# EAGLE design platform_driver_all1 (EAGLE 6.5.0)
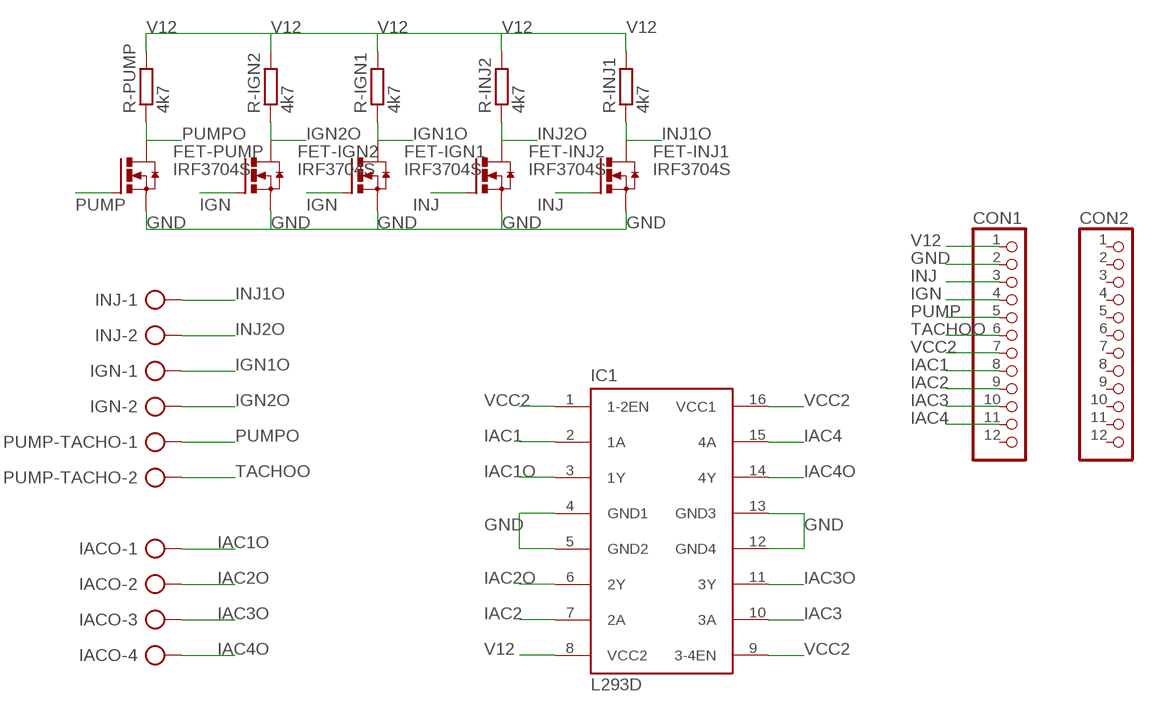
[diagram p0: schematic, sheet 1]

## Parts
CON1  PINHD-1X12  [1X12]
CON2  PINHD-1X12  [1X12]
FET-IGN1  IRF3704S  [D2PACK]
FET-IGN2  IRF3704S  [D2PACK]
FET-INJ1  IRF3704S  [D2PACK]
FET-INJ2  IRF3704S  [D2PACK]
FET-PUMP  IRF3704S  [D2PACK]
IACO  AK300/4  [AK300/4]
IC1  L293D  [DIL16]
IGN  AK300/2  [AK300/2]
INJ  AK300/2  [AK300/2]
PUMP-TACHO  AK300/2  [AK300/2]
R-IGN1  4k7  R-EU_M1206  [M1206]
R-IGN2  4k7  R-EU_M1206  [M1206]
R-INJ1  4k7  R-EU_M1206  [M1206]
R-INJ2  4k7  R-EU_M1206  [M1206]
R-PUMP  4k7  R-EU_M1206  [M1206]

## Nets
GND: CON1.2 FET-IGN1.3(S) FET-IGN2.3(S) FET-INJ1.3(S) FET-INJ2.3(S) FET-PUMP.3(S) IC1.4(GND1) IC1.5(GND2) IC1.12(GND4) IC1.13(GND3)
IAC1: CON1.8 IC1.2(1A)
IAC1O: IACO.1 IC1.3(1Y)
IAC2: CON1.9 IC1.7(2A)
IAC2O: IACO.2 IC1.6(2Y)
IAC3: CON1.10 IC1.10(3A)
IAC3O: IACO.3 IC1.11(3Y)
IAC4: CON1.11 IC1.15(4A)
IAC4O: IACO.4 IC1.14(4Y)
IGN: CON1.4 FET-IGN1.1(G) FET-IGN2.1(G)
IGN1O: FET-IGN1.2(D) IGN.1 R-IGN1.1
IGN2O: FET-IGN2.2(D) IGN.2 R-IGN2.1
INJ: CON1.3 FET-INJ1.1(G) FET-INJ2.1(G)
INJ1O: FET-INJ1.2(D) INJ.1 R-INJ1.1
INJ2O: FET-INJ2.2(D) INJ.2 R-INJ2.1
PUMP: CON1.5 FET-PUMP.1(G)
PUMPO: FET-PUMP.2(D) PUMP-TACHO.1 R-PUMP.1
TACHOO: CON1.6 PUMP-TACHO.2
V12: CON1.1 IC1.8(VCC2) R-IGN1.2 R-IGN2.2 R-INJ1.2 R-INJ2.2 R-PUMP.2
VCC2: CON1.7 IC1.1(1-2EN) IC1.9(3-4EN) IC1.16(VCC1)
Unconnected: CON1.12 CON2.1 CON2.2 CON2.3 CON2.4 CON2.5 CON2.6 CON2.7 CON2.8 CON2.9 CON2.10 CON2.11 CON2.12

## Library data of the parts
CON1 CON2 = pinhead:PINHD-1X12: PIN HEADER
FET-IGN1 FET-IGN2 FET-INJ1 FET-INJ2 FET-PUMP = transistor-power:IRF3704: SMPS MOSFET HEXFET® Power MOSFET Source: http://www.irf.com/product-info/datasheets/data/irf3704.pdf
IACO = con-ptr500:AK300/4: CONNECTOR; OC_FARNELL: unknown; OC_NEWARK: unknown
IC1 = st-microelectronics:L293D: PUSH-PULL 4 CHANNEL DRIVER; MPN: L293D; OC_FARNELL: 9589619; OC_NEWARK: 56P8249
IGN INJ PUMP-TACHO = con-ptr500:AK300/2: CONNECTOR; OC_FARNELL: unknown; OC_NEWARK: unknown
R-IGN1 R-IGN2 R-INJ1 R-INJ2 R-PUMP = resistor:R-EU_: RESISTOR, European symbol

## Board
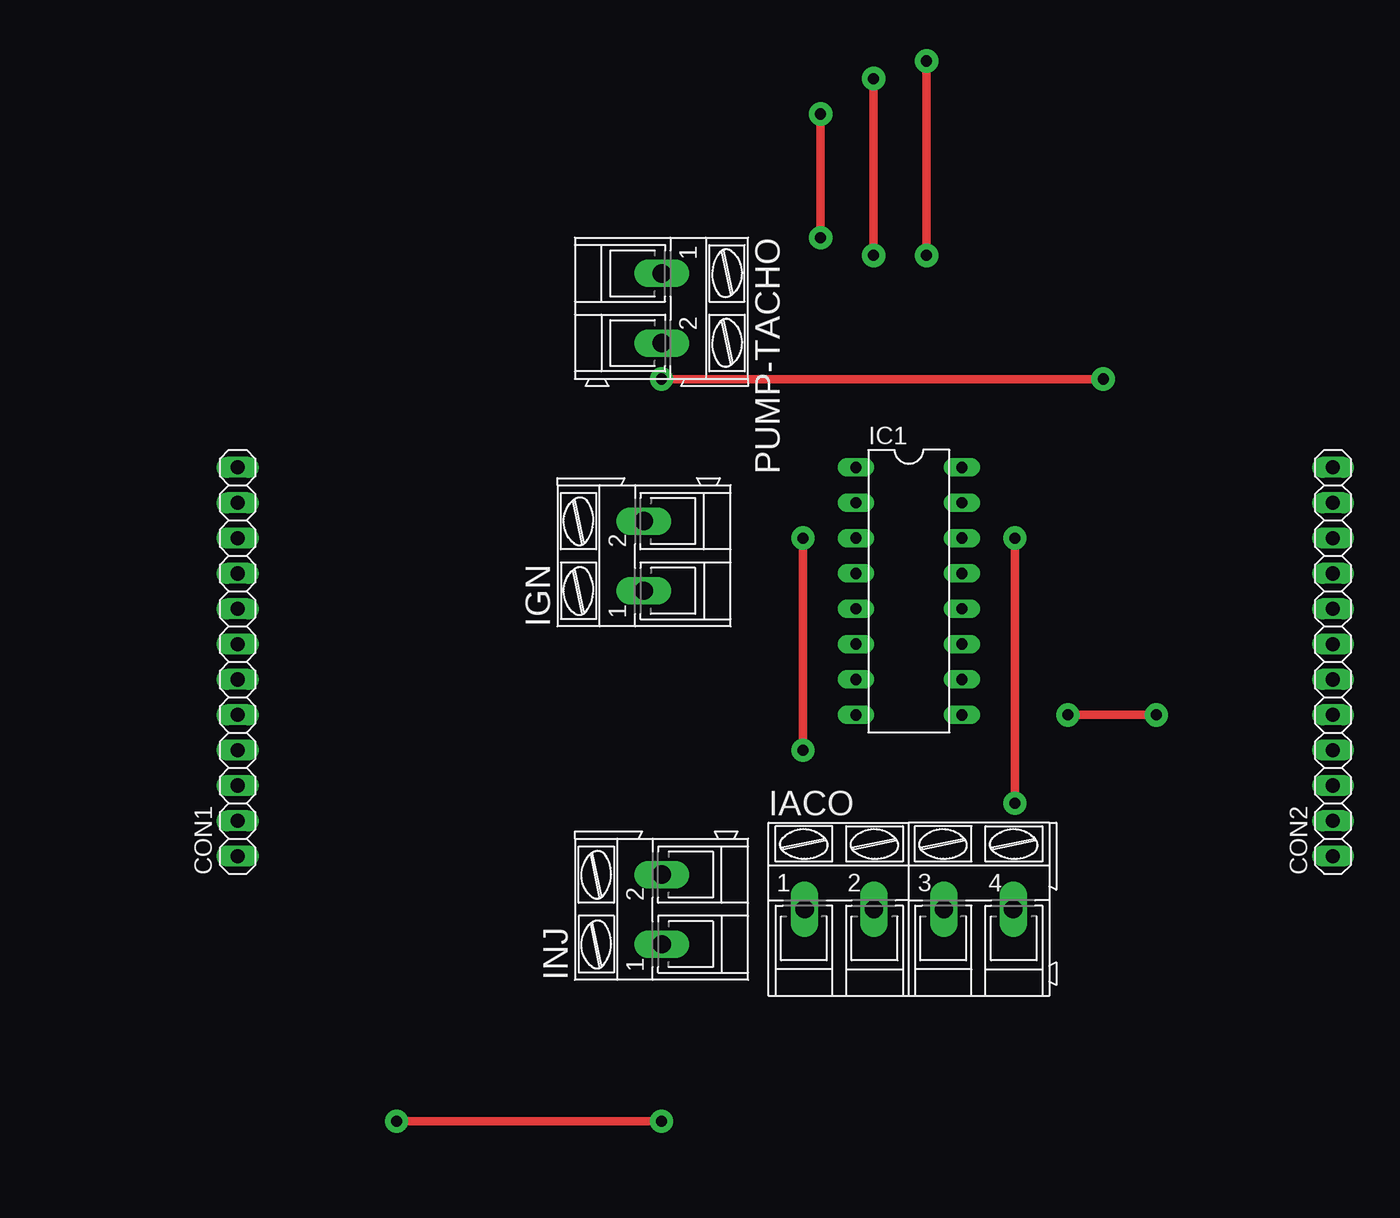
[diagram p1: board, top side]
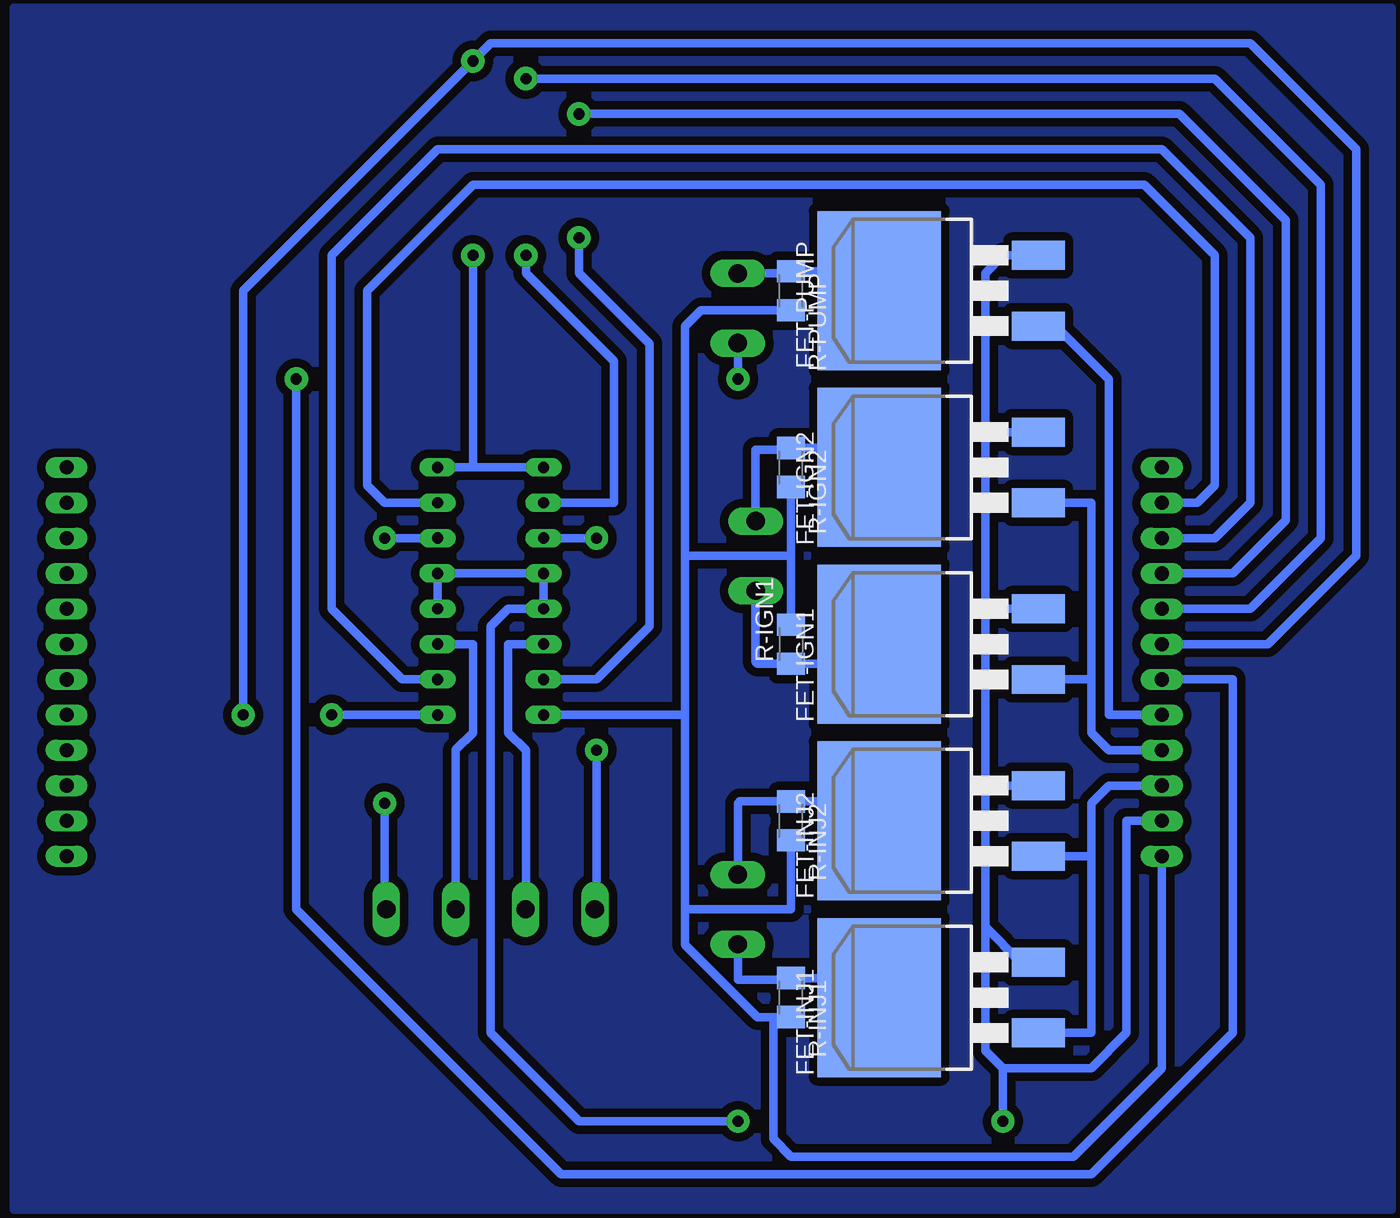
[diagram p2: board, bottom side, seen from below]

No outline drawn. Coordinates in mm, seen from the top.
Copper layers (1*16): Top 0.035mm / dielectric 1.5mm / Bottom 0.035mm
Design rules "default": minimum track width 10mil, minimum drill 24mil, track to track 8mil, track to pad 8mil, pad to pad 8mil, via to via 8mil, smd to smd 8mil, copper to edge 40mil, drill to drill 8mil, minimum pad ring 10mil, minimum via ring 8mil, stop-mask expansion 4mil, vias tented up to drill 0mil, thermal gap 10mil

### Footprints (pad centres in the part's own frame; a part is rotated, then mirrored left to right if it is on the bottom)
1X12 = drill 1.016 long: 1 -13.97,0; 2 -11.43,0; 3 -8.89,0; 4 -6.35,0; 5 -3.81,0; 6 -1.27,0; 7 1.27,0; 8 3.81,0; 9 6.35,0; 10 8.89,0; 11 11.43,0; 12 13.97,0
D2PACK = smd 2.083 x 3.81: 1 -2.54,-8.89; 3 2.54,-8.89 | smd 11.43 x 8.89: 2 0,2.54
AK300/4 = drill 1.321 long: 1 -7.493,0; 2 -2.515,0; 3 2.515,0; 4 7.493,0
DIL16 = drill 0.813 long: 1 -8.89,-3.81; 2 -6.35,-3.81; 3 -3.81,-3.81; 4 -1.27,-3.81; 5 1.27,-3.81; 6 3.81,-3.81; 7 6.35,-3.81; 8 8.89,-3.81; 9 8.89,3.81; 10 6.35,3.81; 11 3.81,3.81; 12 1.27,3.81; 13 -1.27,3.81; 14 -3.81,3.81; 15 -6.35,3.81; 16 -8.89,3.81
AK300/2 = drill 1.321 long: 1 -2.515,0; 2 2.489,0
M1206 = smd 1.6 x 2: 1 -1.4,0; 2 1.4,0

### Placement (x,y rotation side)
CON1  17.78,39.37 90 top
CON2  96.52,39.37 90 top
FET-IGN1  35.56,40.64 90 bottom
FET-IGN2  35.56,53.34 90 bottom
FET-INJ1  35.56,15.24 90 bottom
FET-INJ2  35.56,27.94 90 bottom
FET-PUMP  35.56,66.04 90 bottom
IACO  66.04,21.59 0 top
IC1  66.04,44.45 270 top
IGN  46.99,46.99 90 top
INJ  48.26,21.59 90 top
PUMP-TACHO  48.26,64.77 270 top
R-IGN1  44.45,40.64 90 bottom
R-IGN2  44.45,53.34 270 bottom
R-INJ1  44.45,15.24 270 bottom
R-INJ2  44.45,27.94 270 bottom
R-PUMP  44.45,66.04 270 bottom

### Tracks (layer width: path | path; a pad name or v marks a point on that pad's centre or on a via)
GND  (via drill 0.8 pad 1.68)
  Top 0.61: v48.26,6.35 v29.21,6.35
  Bottom 0.61: IC1.12 IC1.13 IC1.4 IC1.5 64.77,43.18 66.04,41.91 66.04,12.7 59.69,6.35 v48.26,6.35 | FET-INJ1.3 27.94,17.78 30.48,20.32 | 30.48,20.32 30.48,30.48 | 30.48,30.48 30.48,43.18 | 30.48,43.18 30.48,55.88 | 30.48,55.88 30.48,67.31 29.21,68.58 FET-PUMP.3 | FET-IGN2.3 30.48,55.88 | FET-IGN1.3 30.48,43.18 | FET-INJ2.3 30.48,30.48 | CON1.2 20.32,27.94 20.32,12.7 22.86,10.16 29.21,10.16 | 29.21,10.16 30.48,11.43 30.48,20.32 | v29.21,6.35 29.21,10.16
IAC1  (via drill 0.8 pad 1.68)
  Top 0.61: v63.5,81.28 v63.5,68.58
  Bottom 0.61: CON1.8 11.43,43.18 6.35,48.26 6.35,73.66 13.97,81.28 v63.5,81.28 | v63.5,68.58 63.5,67.31 57.15,60.96 57.15,50.8 IC1.2
IAC1O  (via drill 0.8 pad 1.68)
  Top 0.61: v58.42,48.26 v58.42,33.02
  Bottom 0.61: IC1.3 v58.42,48.26 | v58.42,33.02 58.42,21.72 IACO.1
IAC2  (via drill 0.8 pad 1.68)
  Top 0.61: v59.69,78.74 v59.69,69.85
  Bottom 0.61: CON1.9 12.7,45.72 8.89,49.53 8.89,71.12 16.51,78.74 v59.69,78.74 | v59.69,69.85 59.69,67.31 54.61,62.23 54.61,41.91 58.42,38.1 IC1.7
IAC2O
  Bottom 0.61: IC1.6 64.77,40.64 64.77,34.29 63.5,33.02 63.5,21.61 IACO.2
IAC3
  Bottom 0.61: CON1.10 13.97,48.26 11.43,50.8 11.43,69.85 17.78,76.2 69.85,76.2 77.47,68.58 77.47,43.18 72.39,38.1 IC1.10
IAC3O
  Bottom 0.61: IACO.3 68.56,33.05 67.31,34.29 67.31,40.64 IC1.11
IAC4
  Bottom 0.61: CON1.11 15.24,50.8 13.97,52.07 13.97,68.58 19.05,73.66 67.31,73.66 74.93,66.04 74.93,52.07 73.66,50.8 IC1.15
IAC4O  (via drill 0.8 pad 1.68)
  Top 0.61: v73.66,48.26 v73.66,29.21
  Bottom 0.61: IC1.14 v73.66,48.26 | v73.66,29.21 73.66,21.72 IACO.4
IGN
  Bottom 0.61: CON1.4 21.59,33.02 22.86,34.29 22.86,38.1 | 22.86,38.1 22.86,50.8 FET-IGN2.1 | FET-IGN1.1 22.86,38.1
IGN1O
  Bottom 0.61: IGN.1 46.99,39.37 46.86,39.24 R-IGN1.1 39.5,39.24 FET-IGN1.2
IGN2O
  Bottom 0.61: IGN.2 46.99,54.61 44.58,54.61 R-IGN2.1 39.5,54.74 FET-IGN2.2
INJ
  Bottom 0.61: CON1.3 21.59,30.48 22.86,29.21 22.86,25.4 | 22.86,25.4 22.86,12.7 FET-INJ1.1 | FET-INJ2.1 22.86,25.4
INJ1O
  Bottom 0.61: INJ.1 48.26,16.51 44.58,16.51 R-INJ1.1 39.5,16.64 FET-INJ1.2
INJ2O
  Bottom 0.61: FET-INJ2.2 38.1,29.21 38.23,29.34 R-INJ2.1 48.13,29.34 48.26,29.21 INJ.2
N$1
  pour Bottom (isolate 0.61): 1.27,86.36 100.33,86.36 100.33,0 1.27,0
PUMP
  Bottom 0.61: CON1.5 21.59,35.56 21.59,59.69 25.4,63.5 FET-PUMP.1
PUMPO
  Bottom 0.61: PUMP-TACHO.1 44.6,67.28 R-PUMP.1 39.5,67.44 FET-PUMP.2
TACHOO  (via drill 0.8 pad 1.68)
  Top 0.61: v48.26,59.69 v80.01,59.69
  Bottom 0.61: PUMP-TACHO.2 v48.26,59.69 | v80.01,59.69 80.01,21.59 60.96,2.54 22.86,2.54 12.7,12.7 12.7,38.1 CON1.6
V12
  Bottom 0.61: R-PUMP.2 50.93,64.64 52.07,63.5 52.07,46.99 | 52.07,46.99 52.07,35.56 | 52.07,35.56 52.07,21.59 | 52.07,21.59 52.07,19.05 46.86,13.84 45.72,13.84 | R-INJ1.2 45.72,13.84 | R-INJ2.2 44.45,21.59 52.07,21.59 | R-IGN1.2 44.45,46.99 | R-IGN2.2 44.45,46.99 | 44.45,46.99 52.07,46.99 | CON1.1 17.78,10.16 24.13,3.81 44.45,3.81 45.72,5.08 45.72,13.84 | IC1.8 52.07,35.56
VCC2  (via drill 0.8 pad 1.68)
  Top 0.61: v67.31,82.55 v67.31,68.58 | v77.47,35.56 v83.82,35.56
  Bottom 0.61: IC1.1 67.31,53.34 | 67.31,53.34 IC1.16 | CON1.7 10.16,40.64 3.81,46.99 3.81,76.2 11.43,83.82 66.04,83.82 v67.31,82.55 83.82,66.04 v83.82,35.56 | v67.31,68.58 67.31,53.34 | IC1.9 v77.47,35.56